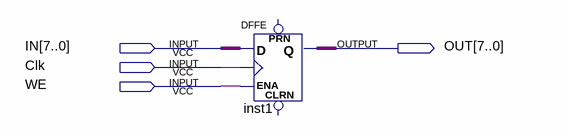
[diagram p0: schematic sheet]
// Quartus schematic RESTR.bdf as structural Verilog: 1 symbols, 4 pins
module RESTR (
  input  [7:0] IN,
  input  Clk,
  input  WE,
  output [7:0] OUT
);

  DFFE inst1[7:0] (.D(IN), .CLK(Clk), .ENA(WE), .Q(OUT));  // open: PRN, CLRN
endmodule
